# EAGLE design motorControllerMk3 (EAGLE 6.4)
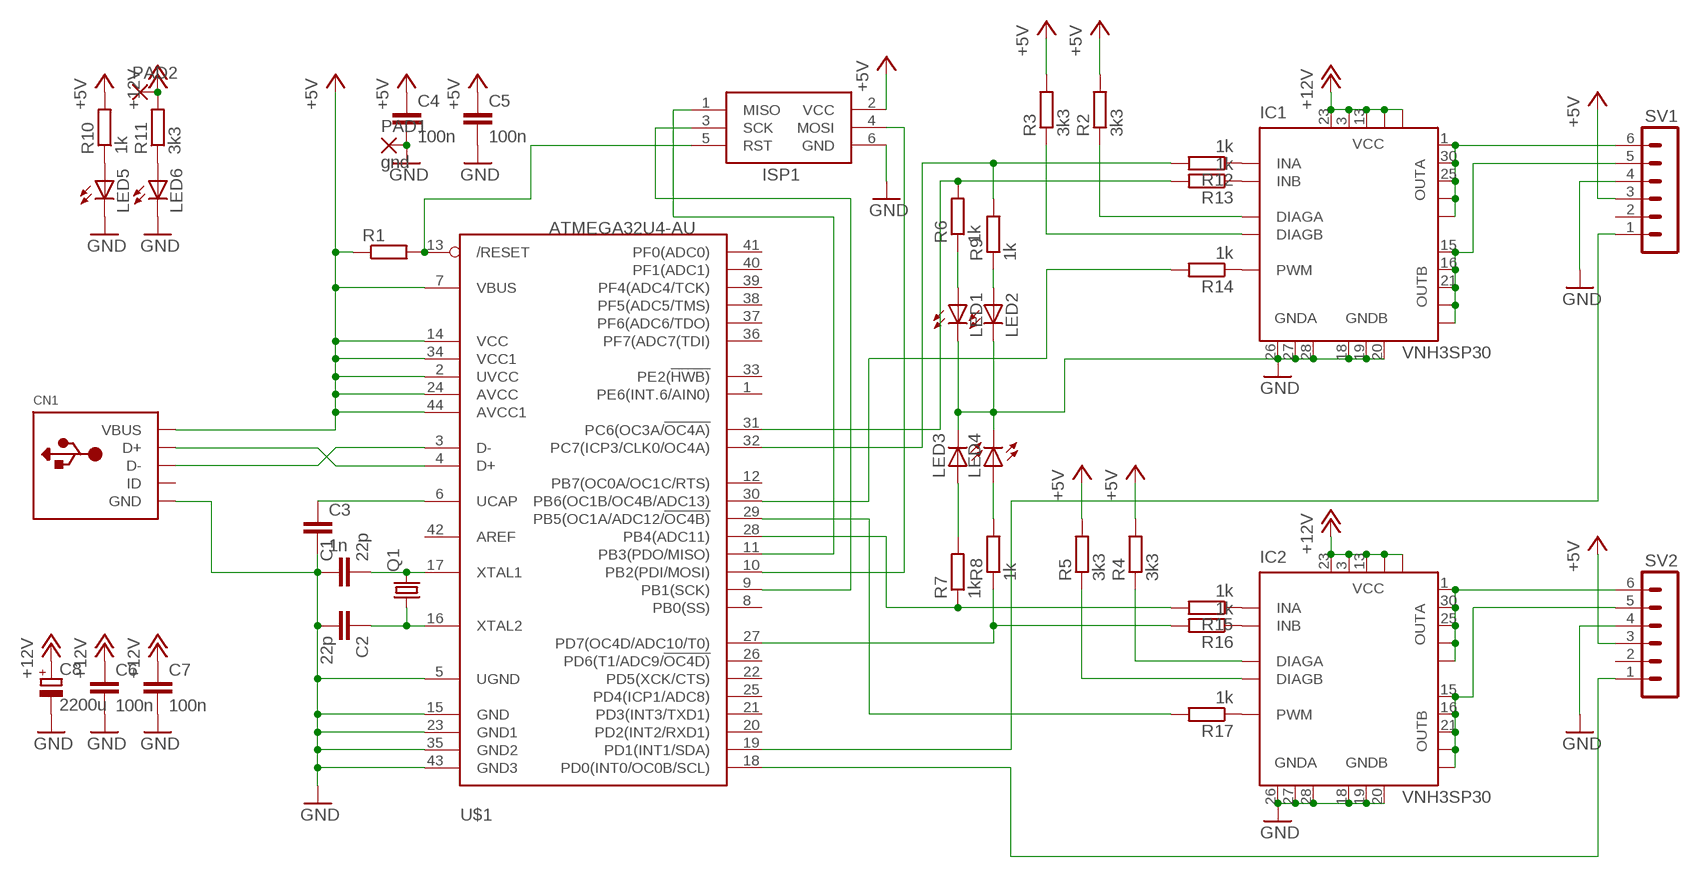
[diagram p0: schematic, sheet 1]

## Parts
C1  22p  C-EUC0805K  [C0805K]
C2  22p  C-EUC0805K  [C0805K]
C3  1n  C-EUC0805K  [C0805K]
C4  100n  C-EUC0805K  [C0805K]
C5  100n  C-EUC0805K  [C0805K]
C6  100n  C-EUC0805K  [C0805K]
C7  100n  C-EUC0805K  [C0805K]
C8  2200u  CPOL-EUE5-8.5  [E5-8,5]
CN1  USBMINIB  [USB-MINIB]
IC1  VNH3SP30  [MULTIPOWERSO-30]
IC2  VNH3SP30  [MULTIPOWERSO-30]
ISP1  AVRISP-6  [AVRISP]
LED1  LEDSML1206  [SML1206]
LED2  LEDSML1206  [SML1206]
LED3  LEDSML1206  [SML1206]
LED4  LEDSML1206  [SML1206]
LED5  LEDSML1206  [SML1206]
LED6  LEDSML1206  [SML1206]
PAD1  gnd  3,81/1,1  [3,81/1,1]
PAD2  3,81/1,1  [3,81/1,1]
Q1  CRYSTALHC49U-V  [HC49U-V]
R1  R-EU_M0805  [M0805]
R2  3k3  R-EU_M0805  [M0805]
R3  3k3  R-EU_M0805  [M0805]
R4  3k3  R-EU_M0805  [M0805]
R5  3k3  R-EU_M0805  [M0805]
R6  1k  R-EU_M0805  [M0805]
R7  1k  R-EU_M0805  [M0805]
R8  1k  R-EU_M0805  [M0805]
R9  1k  R-EU_M0805  [M0805]
R10  1k  R-EU_M0805  [M0805]
R11  3k3  R-EU_M0805  [M0805]
R12  1k  R-EU_M0805  [M0805]
R13  1k  R-EU_M0805  [M0805]
R14  1k  R-EU_M0805  [M0805]
R15  1k  R-EU_M0805  [M0805]
R16  1k  R-EU_M0805  [M0805]
R17  1k  R-EU_M0805  [M0805]
SV1  MA06-1  [MA06-1]
SV2  MA06-1  [MA06-1]
U$1  ATMEGA32U4-AU  [TQFP44]

## Nets
+5V: C4.1 C5.1 CN1.VBUS ISP1.2(VCC) R1.1 R2.2 R3.2 R4.2 R5.2 R10.2 SV1.3 SV2.3 U$1.2(UVCC) U$1.7(VBUS) U$1.14(VCC) U$1.24(AVCC) U$1.34(VCC1) U$1.44(AVCC1)
+12V: C6.1 C7.1 C8.+ IC1.3(VCC) IC1.13(VCC) IC1.23(VCC) IC1.VCC IC1.VCC@1(VCC) IC2.3(VCC) IC2.13(VCC) IC2.23(VCC) IC2.VCC IC2.VCC@1(VCC) PAD2.1(P) R11.2
GND: C1.1 C2.2 C3.2 C4.2 C5.2 C6.2 C7.2 C8.- CN1.GND IC1.18(GNDB) IC1.19(GNDB) IC1.20(GNDB) IC1.26(GNDA) IC1.27(GNDA) IC1.28(GNDA) IC2.18(GNDB) IC2.19(GNDB) IC2.20(GNDB) IC2.26(GNDA) IC2.27(GNDA) IC2.28(GNDA) ISP1.6(GND) LED1.C LED2.C LED3.C LED4.C LED5.C LED6.C PAD1.1(P) SV1.4 SV2.4 U$1.5(UGND) U$1.15(GND) U$1.23(GND1) U$1.35(GND2) U$1.43(GND3)
N$1: ISP1.3(SCK) U$1.9(PB1(SCK))
N$2: C2.1 Q1.1 U$1.16(XTAL2)
N$3: C1.2 Q1.2 U$1.17(XTAL1)
N$4: C3.1 U$1.6(UCAP)
N$5: ISP1.5(RST) R1.2 U$1.13(/RESET)
N$6: ISP1.4(MOSI) U$1.10(PB2(PDI/MOSI))
N$7: ISP1.1(MISO) U$1.11(PB3(PDO/MISO))
N$8: R17.2 U$1.29(PB5(OC1A/ADC12/!OC4B))
N$9: R14.2 U$1.30(PB6(OC1B/OC4B/ADC13))
N$10: CN1.D+ U$1.4(D+)
N$11: CN1.D- U$1.3(D-)
N$12: SV2.1 U$1.18(PD0(INT0/OC0B/SCL))
N$13: IC1.1(OUTA) IC1.25(OUTA) IC1.30(OUTA) IC1.OUTA IC1.OUTA@1(OUTA) SV1.6
N$14: IC1.15(OUTB) IC1.16(OUTB) IC1.21(OUTB) IC1.OUTB IC1.OUTB@1(OUTB) SV1.5
N$15: IC2.15(OUTB) IC2.16(OUTB) IC2.21(OUTB) IC2.OUTB IC2.OUTB@1(OUTB) SV2.5
N$16: IC2.1(OUTA) IC2.25(OUTA) IC2.30(OUTA) IC2.OUTA IC2.OUTA@1(OUTA) SV2.6
N$17: SV1.1 U$1.19(PD1(INT1/SDA))
N$18: IC2.6(DIAGA) R4.1
N$19: IC2.10(DIAGB) R5.1
N$20: IC1.6(DIAGA) R2.1
N$21: IC1.10(DIAGB) R3.1
N$22: LED4.A R8.2
N$23: R8.1 R16.2 U$1.27(PD7(OC4D/ADC10/T0))
N$24: R7.1 R15.2 U$1.28(PB4(ADC11))
N$25: R6.2 R13.2 U$1.31(PC6(OC3A/!OC4A))
N$26: R9.2 R12.2 U$1.32(PC7(ICP3/CLK0/OC4A))
N$27: LED3.A R7.2
N$28: LED5.A R10.1
N$29: LED6.A R11.1
N$30: LED2.A R9.1
N$31: LED1.A R6.1
N$32: IC1.5(INA) R12.1
N$33: IC1.11(INB) R13.1
N$34: IC1.8(PWM) R14.1
N$35: IC2.5(INA) R15.1
N$36: IC2.11(INB) R16.1
N$37: IC2.8(PWM) R17.1
Unconnected: CN1.ID SV1.2 SV2.2 U$1.1(PE6(INT.6/AIN0)) U$1.8(PB0(SS)) U$1.12(PB7(OC0A/OC1C/RTS)) U$1.20(PD2(INT2/RXD1)) U$1.21(PD3(INT3/TXD1)) U$1.22(PD5(XCK/CTS)) U$1.25(PD4(ICP1/ADC8)) U$1.26(PD6(T1/ADC9/!OC4D)) U$1.33(PE2(!HWB)) U$1.36(PF7(ADC7(TDI)) U$1.37(PF6(ADC6/TDO)) U$1.38(PF5(ADC5/TMS)) U$1.39(PF4(ADC4/TCK)) U$1.40(PF1(ADC1)) U$1.41(PF0(ADC0)) U$1.42(AREF)

## Library data of the parts
C1-C7 = rcl:C-EU: CAPACITOR, European symbol
C8 = rcl:CPOL-EU: POLARIZED CAPACITOR, European symbol
CN1 = adafruit:USB: USB Connectors USBMINIB - Surface Mount Female Mini-B USB Connector 4UConnector: 06564 By microbuilder.eu Thru-hole RA Female Mini-B USB Connector 4UConnector: 18732 By ladyada.net
IC1 IC2 = st-microelectronics:VNH3SP30: FULLY INTEGRATED H-BRIDGE MOTOR DRIVER Source: http://pdf1.alldatasheet.com/datasheet-pdf/view/84563/STMICROELECTRONICS/VNH3SP30.html; MPN: VNH3SP30-E; OC_FARNELL: 1739420; OC_NEWARK: 33R1486
ISP1 = adafruit:AVRISP: AVR ISP HEADER Standard 6 pin header for AVR programming
LED1-LED6 = led:LED: LED OSRAM: - CHIPLED LG R971, LG N971, LY N971, LG Q971, LY Q971, LO R971, LY R971 LH N974, LH R974 LS Q976, LO Q976, LY Q976 LO Q996 - Hyper CHIPLED LW Q18S LB Q993, LB Q99A, LB R99A - SideLED LS A670, LO A670, LY A670, LG A670, LP A670 LB A673, LV A673, LT A673, LW A673 LH A674 LY A675 LS A676, LA A676, LO A676, LY A676, LW A676 LS A679, LY A679, LG A679 - Hyper Micro SIDELED® LS Y876, LA Y876, LO Y876, LY Y876 LT Y87S - SmartLED LW L88C, LW L88S LB L89C, LB L89S, LG L890 LS L89K, LO L89K, LY L89K LS L896, LA L896, LO L896, LY L896 - TOPLED LS T670, LO T670, LY T670, LG T670, LP T670 LSG T670, LSP T670, LSY T670, LOP T670, LYG T670 LG T671, LOG T671, LSG T671 LB T673, LV T673, LT T673, LW T673 LH T674 LS T676, LA T676, LO T676, LY T676, LB T676, LH T676, LSB T676, LW T676 LB T67C, LV T67C, LT T67C, LS T67K, LO T67K, LY T67K, LW E67C LS E67B, LA E67B, LO E67B, LY E67B, LB E67C, LV E67C, LT E67C LW T67C LS T679, LY T679, LG T679 LS T770, LO T770, LY T770, LG T770, LP T770 LB T773, LV T773, LT T773, LW T773 LH T774 LS E675, LA E675, LY E675, LS T675 LS T776, LA T776, LO T776, LY T776, LB T776 LHGB T686 LT T68C, LB T68C - Hyper Mini TOPLED® LB M676 - Mini TOPLED Santana® LG M470 LS M47K, LO M47K, LY M47K Source: http://www.osram.convergy.de LUXEON: - LUMILED® LXK2-PW12-R00, LXK2-PW12-S00, LXK2-PW14-U00, LXK2-PW14-V00 LXK2-PM12-R00, LXK2-PM12-S00, LXK2-PM14-U00 LXK2-PE12-Q00, LXK2-PE12-R00, LXK2-PE12-S00, LXK2-PE14-T00, LXK2-PE14-U00 LXK2-PB12-K00, LXK2-PB12-L00, LXK2-PB12-M00, LXK2-PB14-N00, LXK2-PB14-P00, LXK2-PB14-Q00 LXK2-PR12-L00, LXK2-PR12-M00, LXK2-PR14-Q00, LXK2-PR14-R00 LXK2-PD12-Q00, LXK2-PD12-R00, LXK2-PD12-S00 LXK2-PH12-R00, LXK2-PH12-S00 LXK2-PL12-P00, LXK2-PL12-Q00, LXK2-PL12-R00 Source: www.luxeon.com KINGBRIGHT: KA-3528ASYC Source: www.kingbright.com
PAD1 PAD2 = wirepad:3,81/1,1: THROUGH-HOLE PAD
Q1 = adafruit:CRYSTAL: CRYSTAL; OC_FARNELL: 1666969; OC_NEWARK: unknown
R1-R17 = rcl:R-EU_: RESISTOR, European symbol
SV1 SV2 = con-lstb:MA06-1: PIN HEADER; OC_FARNELL: unknown; OC_NEWARK: unknown
U$1 = adafruit:ATMEGA32U4: http://www.ladyada.net/library/eagle

## Board
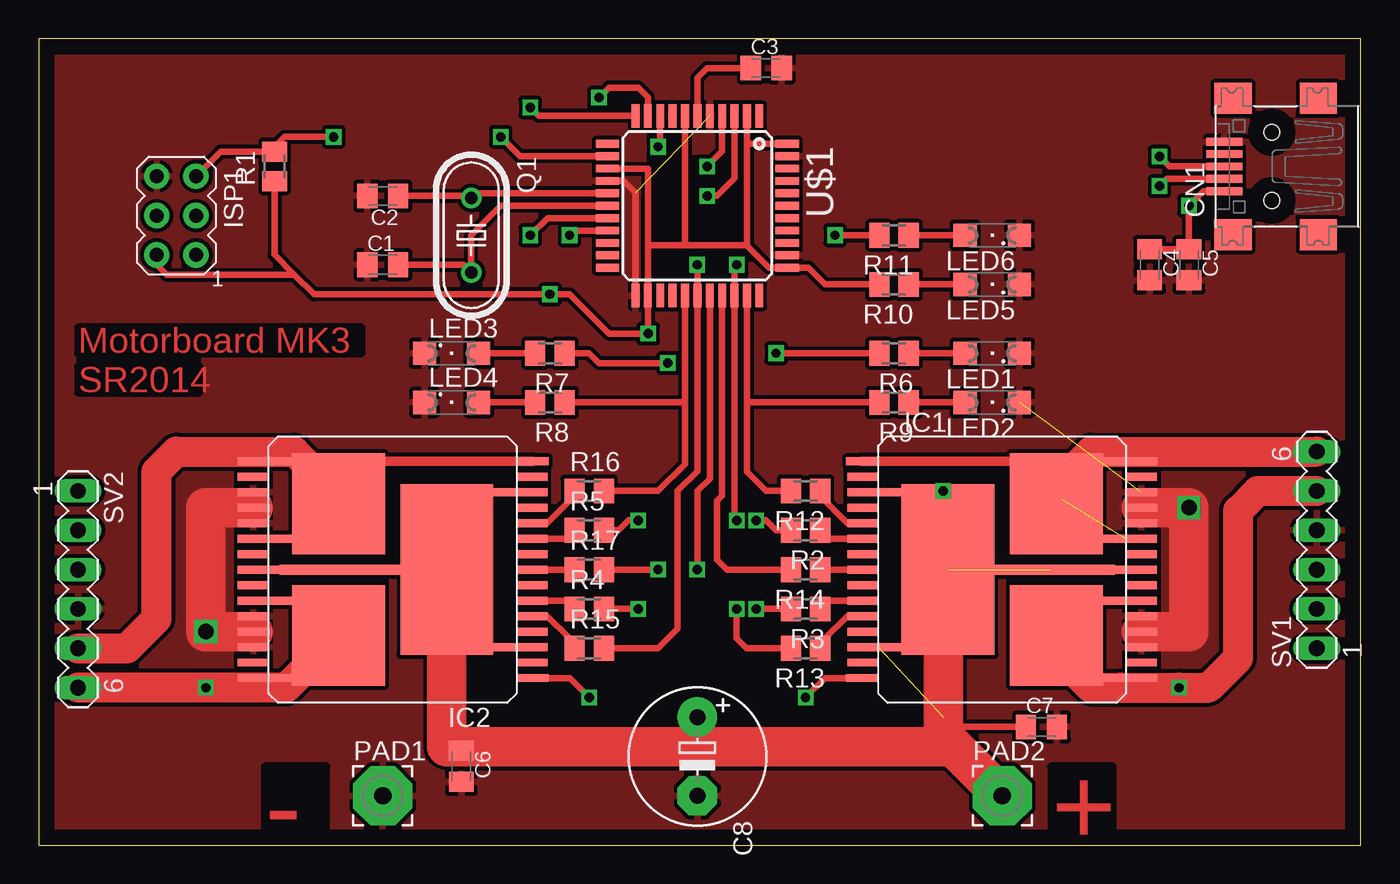
[diagram p1: board, top side]
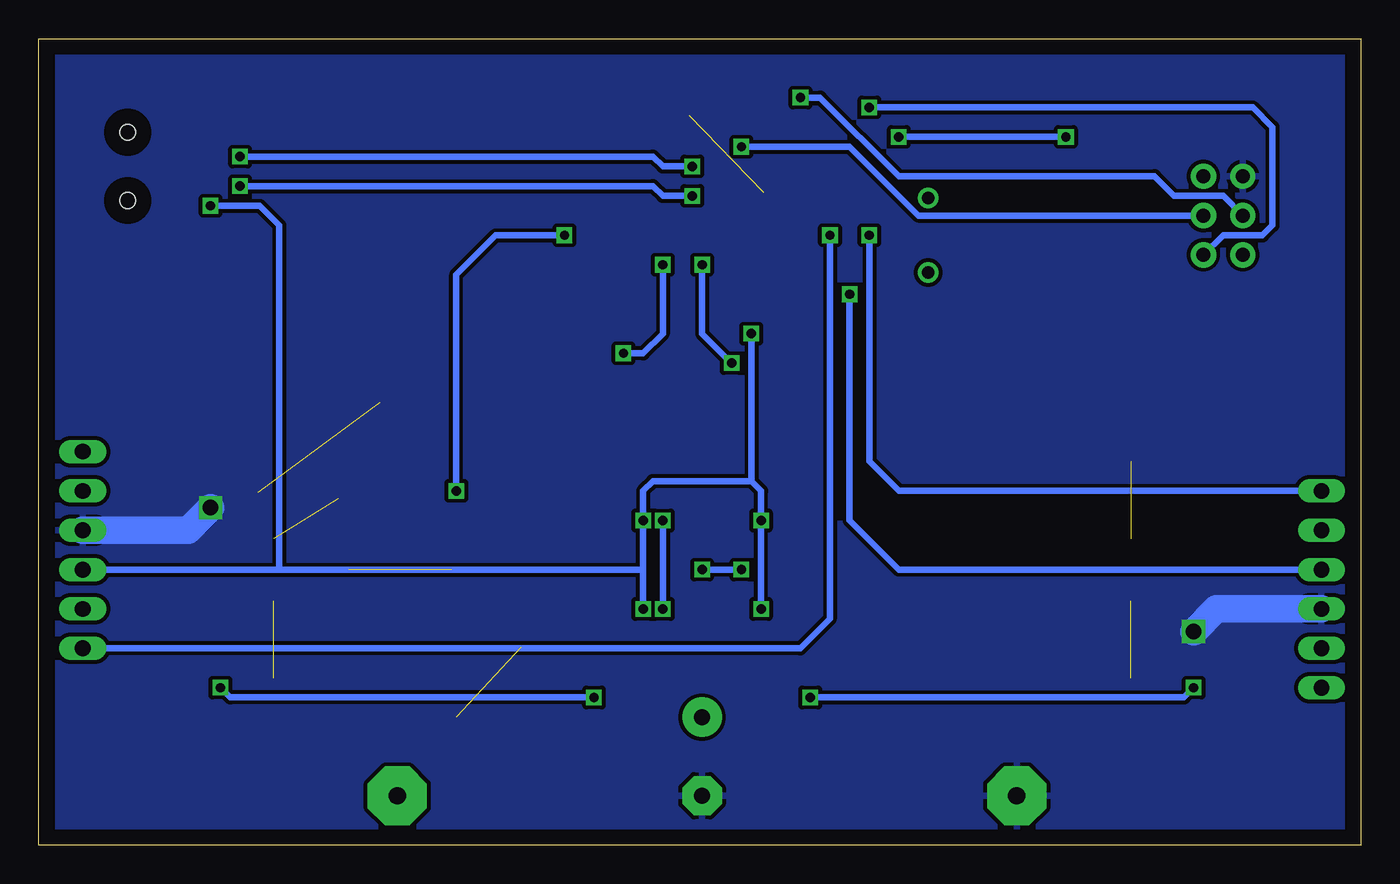
[diagram p2: board, bottom side, seen from below]

Size 85.39 x 52.06 mm. Coordinates in mm from the lower left corner, seen from the top.
Outline: 0,0 85.39,0 85.39,52.06 0,52.06 0,0
Copper layers (1*16): Top 0.035mm / dielectric 1.5mm / Bottom 0.035mm
Design rules "default *": minimum track width 10mil, minimum drill 24mil, track to track 10mil, track to pad 10mil, pad to pad 10mil, via to via 10mil, smd to smd 10mil, copper to edge 40mil, drill to drill 8mil, minimum pad ring 10mil, minimum via ring 8mil, stop-mask expansion 4mil, vias tented up to drill 0mil, thermal gap 10mil

### Footprints (pad centres in the part's own frame; a part is rotated, then mirrored left to right if it is on the bottom)
C0805K = smd 1.3 x 1.6: 1 -1,0; 2 1,0
E5-8,5 = drill 1.016 pad 2.54: + -2.54,0 | drill 1.016 pad 2.54 octagon: - 2.54,0
USB-MINIB = smd 0.5 x 2.308: D+ 0,4.064; D- -0.8,4.064; GND 1.6,4.064; ID 0.8,4.064; VBUS -1.6,4.064 | smd 2 x 2.4: GND1 -4.4,-2; GND2 -4.4,3.5; GND3 4.4,3.5; GND4 4.4,-2 | hole 1: -2.2,1; 2.2,1
MULTIPOWERSO-30 = smd 0.508 x 2: 1 -7,-9.08; 2 -6,-9; 4 -4,-9; 5 -3,-9; 6 -2,-9; 7 -1,-9; 8 0,-9; 9 1,-9; 10 2,-9; 11 3,-9; 12 4,-9; 14 6,-9; 15 7,-9.08; 17 6,9; 18 5,9; 19 4,9; 20 3,9; 22 1,9; 24 -1,9; 26 -3,9; 27 -4,9; 28 -5,9; 29 -6,9 | smd 0.508 x 4: 3 -5,-8; 13 5,-8; 16 7,8; 21 2,8; 23 0,8; 25 -2,8; 30 -7,8 | smd 6.5 x 6: OUTA -4.25,3.5; OUTB 4.25,3.5 | smd 2 x 0.508: OUTA@1 -5.73,2.325; OUTB@1 4.46,2.325 | smd 11 x 6: VCC 0,-3.5 | smd 0.65 x 8.3: VCC@1 0,3.145
AVRISP = drill 0.9 pad 1.626: 1 -1.27,2.54; 2 1.27,2.54; 3 -1.27,0; 4 1.27,0; 5 -1.27,-2.54; 6 1.27,-2.54
SML1206 = smd 1.5 x 1.5: A 1.75,0; C -1.75,0
3,81/1,1 = drill 1.118 pad 3.81 octagon: 1 0,0
HC49U-V = drill 0.813: 1 -2.413,0; 2 2.413,0
M0805 = smd 1.3 x 1.6: 1 -0.95,0; 2 0.95,0
MA06-1 = drill 1.016 long: 1 -6.35,0; 2 -3.81,0; 3 -1.27,0; 4 1.27,0; 5 3.81,0; 6 6.35,0
TQFP44 = smd 1.5 x 0.5: 1 -5.8,4; 2 -5.8,3.2; 3 -5.8,2.4; 4 -5.8,1.6; 5 -5.8,0.8; 6 -5.8,0; 7 -5.8,-0.8; 8 -5.8,-1.6; 9 -5.8,-2.4; 10 -5.8,-3.2; 11 -5.8,-4; 23 5.8,-4; 24 5.8,-3.2; 25 5.8,-2.4; 26 5.8,-1.6; 27 5.8,-0.8; 28 5.8,0; 29 5.8,0.8; 30 5.8,1.6; 31 5.8,2.4; 32 5.8,3.2; 33 5.8,4 | smd 0.5 x 1.5: 12 -4,-5.8; 13 -3.2,-5.8; 14 -2.4,-5.8; 15 -1.6,-5.8; 16 -0.8,-5.8; 17 0,-5.8; 18 0.8,-5.8; 19 1.6,-5.8; 20 2.4,-5.8; 21 3.2,-5.8; 22 4,-5.8; 34 4,5.8; 35 3.2,5.8; 36 2.4,5.8; 37 1.6,5.8; 38 0.8,5.8; 39 0,5.8; 40 -0.8,5.8; 41 -1.6,5.8; 42 -2.4,5.8; 43 -3.2,5.8; 44 -4,5.8

### Placement (x,y rotation side)
C1  22.23,37.47 0 top
C2  22.23,41.91 180 top
C3  46.99,50.16 0 top
C4  71.75,37.47 270 top
C5  74.3,37.47 270 top
C6  27.3,5.08 270 top
C7  64.77,7.62 0 top
C8  42.55,5.71 270 top
CN1  80.64,43.81 90 top
IC1  62.23,17.78 270 top
IC2  22.86,17.78 90 top
ISP1  8.89,40.64 180 top
LED1  61.59,31.75 180 top
LED2  61.59,28.57 180 top
LED3  26.67,31.75 0 top
LED4  26.67,28.57 0 top
LED5  61.59,36.2 180 top
LED6  61.59,39.37 180 top
PAD1  22.23,3.17 0 top
PAD2  62.23,3.17 0 top
Q1  27.94,39.37 270 top
R1  15.24,43.81 90 top
R2  49.53,20.32 180 top
R3  49.53,15.24 180 top
R4  35.56,15.24 0 top
R5  35.56,20.32 0 top
R6  55.24,31.75 180 top
R7  33.02,31.75 180 top
R8  33.02,28.57 180 top
R9  55.24,28.57 180 top
R10  55.24,36.2 180 top
R11  55.24,39.37 180 top
R12  49.53,22.86 180 top
R13  49.53,12.7 180 top
R14  49.53,17.78 180 top
R15  35.56,12.7 0 top
R16  35.56,22.86 0 top
R17  35.56,17.78 0 top
SV1  82.55,19.05 90 top
SV2  2.54,16.51 270 top
U$1  42.55,41.27 270 top

### Tracks (layer width: path | path; a pad name or v marks a point on that pad's centre or on a via)
+5V  (via drill 0.6)
  Top 0.406: R4.2 v38.73,15.24 | R3.2 v46.35,15.24 | R5.2 37.47,20.32 38.1,20.95 v38.73,20.95 | R2.2 47.62,20.32 46.99,20.95 v46.35,20.95 | 39.36,38.74 U$1.24 39.34,33.68 v39.37,33.02 36.83,33.02 34.29,35.56 v33.02,35.56 17.78,35.56 16.51,36.83 | 39.36,38.74 39.37,41.27 | 39.37,41.27 39.37,41.91 | 39.37,41.27 39.37,41.28 39.37,43.67 U$1.14 | 45.72,38.73 47.18,37.27 U$1.34 49.72,37.27 50.8,36.2 R10.2 | 45.72,38.73 41.74,38.73 | 41.74,38.73 39.36,38.73 39.36,38.74 | U$1.7 41.74,38.73 | U$1.2 45.74,45.27 | 45.74,45.27 45.74,38.73 45.72,38.73 | U$1.44 45.74,45.27 | CN1.VBUS 75.23,42.22 v74.3,41.27 C5.1 C4.1 | 16.51,36.83 15.24,38.1 R1.1 | ISP1.2 7.62,37.47 8.26,36.83 16.51,36.83
  Bottom 0.406: v38.73,15.24 v38.73,20.95 38.73,22.86 39.37,23.5 | v46.35,15.24 46.35,17.78 | 46.35,17.78 v46.35,20.95 46.35,22.86 45.72,23.5 39.37,23.5 | v39.37,33.02 39.37,23.5 | SV1.3 69.85,17.78 | SV2.3 29.84,17.78 33.02,20.95 v33.02,35.56 | v74.3,41.27 71.12,41.27 69.85,40.01 69.85,17.78 | 69.85,17.78 46.35,17.78
+12V  (via drill 0.6)  (2 unrouted)
  Top 0.406: 58.42,6.35 43.18,6.35 42.55,5.71 | v51.44,39.37 R11.2 | 27.94,6.35 27.94,6.99 27.3,6.99 26.67,6.35 26.67,12.06 26.04,12.7 30.78,12.7 IC2.3 | C7.1 59.05,7.62 58.42,8.26 | IC2.13 27.86,22.78 26.67,21.59 26.67,18.09 IC2.VCC IC2.VCC@1 IC2.23 | IC1.3 58.34,22.78 v58.42,22.86 58.42,17.78 | IC1.VCC@1 IC1.23 | C6.1 25.73,7.62 26.36,6.99
  Top 1.778: 42.55,5.71 C8.+
  Top 2.54: IC2.VCC 26.36,6.99 26.36,6.35 26.67,6.35 27.94,6.35 58.42,6.35 58.42,6.99 | 58.42,6.99 58.42,8.26 58.42,17.47 IC1.VCC 58.42,17.78 | PAD2.1 58.42,6.99
  Bottom 0.406: v51.44,39.37 55.88,39.37 58.42,36.83 v58.42,22.86
GND  (via drill 1)  (2 unrouted)
  Top 0.406: U$1.23 38.55,42.1 37.77,42.88 U$1.15
  Top 2.54: IC2.19 10.79,21.78 v10.79,13.78 IC2.27 | IC1.27 v74.3,21.78 74.3,13.78 IC1.19
  Bottom 1.778: SV1.4 75.75,20.32 v74.3,21.78 | SV2.4 9.34,15.24 v10.79,13.78
  pour Top: 0,52.07 84.45,52.07 84.45,0 0,0
  pour Bottom: 0,52.07 0,0 84.45,0 84.45,52.07
N$1  (via drill 0.6)
  Top 0.406: U$1.9 40.15,45.23 v40.01,45.09
  Bottom 0.406: v40.01,45.09 33.02,45.09 28.57,40.64 ISP1.3
N$2
  Top 0.406: U$1.16 28.23,42.08 Q1.1 27.81,41.91 C2.1
N$3
  Top 0.406: U$1.17 29.84,41.27 27.94,39.37 Q1.2 | 27.81,36.83 Q1.2 | C1.2 27.43,37.47 Q1.2
N$4
  Top 0.406: U$1.6 42.55,49.53 43.18,50.16 C3.1
N$5  (via drill 0.6)
  Top 0.406: U$1.13 31.09,44.48 v29.84,45.72 | v19.05,45.72 15.88,45.72 15.24,45.09 R1.2 11.74,44.77 ISP1.5
  Bottom 0.406: v29.84,45.72 v19.05,45.72
N$6  (via drill 0.6)
  Top 0.406: U$1.10 39.34,48.28 38.73,48.9 36.83,48.9 v36.2,48.26
  Bottom 0.406: v36.2,48.26 34.92,48.26 29.84,43.18 13.34,43.18 12.06,41.91 8.89,41.91 ISP1.4
N$7  (via drill 0.6)
  Top 0.406: U$1.11 32.3,47.08 v31.75,47.62
  Bottom 0.406: v31.75,47.62 6.99,47.62 5.71,46.35 5.71,40.01 6.35,39.37 8.89,39.37 ISP1.1
N$8  (via drill 0.6)
  Top 0.406: R17.2 v40.01,17.78 | U$1.29 43.34,23.66 42.55,22.86 v42.55,17.78
  Bottom 0.406: v40.01,17.78 v42.55,17.78
N$9
  Top 0.406: R14.2 44.45,17.78 43.81,18.41 43.81,22.23 44.15,22.55 U$1.30
N$10  (via drill 0.6)
  Top 0.406: U$1.4 44.15,44.78 v43.18,43.81 | CN1.D+ 73.03,43.81 v72.39,44.45
  Bottom 0.406: v72.39,44.45 45.72,44.45 45.09,43.81 v43.18,43.81
N$11  (via drill 0.6)
  Top 0.406: U$1.3 44.95,43.04 43.81,41.91 v43.18,41.91 | CN1.D- 72.86,43.02 v72.39,42.55
  Bottom 0.406: v72.39,42.55 45.72,42.55 45.09,41.91 v43.18,41.91
N$12  (via drill 0.6)
  Top 0.406: U$1.18 32.85,40.48 v31.75,39.37
  Bottom 0.406: v31.75,39.37 31.75,24.77 29.84,22.86 SV2.1
N$13  (1 unrouted)
  Top 0.406: 66.06,23.51 66.06,22.36 IC1.OUTA | IC1.30 68.56,24.78 67.94,25.4
  Top 0.61: IC1.1 62.98,24.78 IC1.OUTA
  Top 1.93: IC1.OUTA@1 66.06,23.51 67.94,25.4 SV1.6
N$14  (via drill 0.6)  (1 unrouted)
  Top 0.406: IC1.15 50.78,10.78 v49.53,9.53 | IC1.OUTB 64.77,13.53 IC1.OUTB@1 | IC1.16 70.23,10.54 69.85,10.16
  Top 1.93: IC1.OUTB 65.73,12.38 67.94,10.16 69.85,10.16 v73.66,10.16 75.56,10.16 77.47,12.06 77.47,21.59 78.74,22.86 SV1.5
  Bottom 0.406: v49.53,9.53 73.03,9.53 v73.66,10.16
N$15  (1 unrouted)
  Top 0.406: IC2.OUTB@1 19.57,22.24 IC2.OUTB | 16.51,25.4 15.48,25.4 IC2.16
  Top 0.61: IC2.15 22.11,24.78 IC2.OUTB
  Top 1.93: SV2.5 5.71,12.7 7.62,14.61 7.62,24.13 8.89,25.4 16.51,25.4 19.36,22.55 IC2.OUTB
N$16  (via drill 0.6)  (1 unrouted)
  Top 0.406: IC2.1 34.3,10.78 v35.56,9.53 | IC2.OUTA@1 20.54,12.36 IC2.OUTA | 15.99,10.16 15.48,10.16 IC2.30
  Top 1.93: IC2.OUTA 15.99,10.16 v10.79,10.16 SV2.6
  Bottom 0.406: v35.56,9.53 11.43,9.53 v10.79,10.16
N$17  (via drill 0.6)
  Top 0.406: U$1.19 34.59,39.67 v34.29,39.37
  Bottom 0.406: v34.29,39.37 34.29,14.61 36.2,12.7 SV1.1
N$18
  Top 0.406: IC2.6 34.07,15.78 R4.1
N$19
  Top 0.406: IC2.10 34.07,19.78 R5.1
N$20
  Top 0.406: IC1.6 51.02,19.78 R2.1
N$21
  Top 0.406: IC1.10 51.02,15.78 R3.1
N$22
  Top 0.406: R8.2 LED4.A
N$23
  Top 0.406: U$1.27 41.74,28.57 | 41.74,28.57 41.74,24.6 40.01,22.86 R16.2 | R8.1 41.74,28.57
N$24  (via drill 0.6)
  Top 0.406: R15.2 40.01,12.7 41.27,13.97 41.27,22.86 42.55,24.13 U$1.28 v42.55,37.47 | v40.64,31.11 36.2,31.11 35.56,31.75 R7.1
  Bottom 0.406: v42.55,37.47 42.55,33.02 v40.64,31.11
N$25  (via drill 0.6)
  Top 0.406: v45.09,20.95 44.95,21.09 U$1.31 44.95,37.33 v45.09,37.47 | v45.09,15.24 45.09,13.34 45.72,12.7 R13.2 | v47.62,31.75 R6.2
  Bottom 0.406: v45.09,20.95 v45.09,15.24 | v45.09,37.47 45.09,33.02 46.35,31.75 v47.62,31.75
N$26
  Top 0.406: U$1.32 45.74,28.57 | 45.74,28.57 45.74,24.11 46.99,22.86 R12.2 | R9.2 45.74,28.57
N$27
  Top 0.406: R7.2 LED3.A
N$28
  Top 0.406: R10.1 LED5.A
N$29
  Top 0.406: R11.1 LED6.A
N$30
  Top 0.406: R9.1 LED2.A
N$31
  Top 0.406: R6.1 LED1.A
N$32
  Top 0.406: IC1.5 52.24,20.78 50.8,22.23 50.8,22.54 R12.1
N$33
  Top 0.406: IC1.11 52.24,14.78 50.8,13.34 50.8,13.02 R13.1
N$34
  Top 0.406: IC1.8 R14.1
N$35
  Top 0.406: IC2.5 32.84,14.78 34.29,13.34 34.29,13.02 R15.1
N$36
  Top 0.406: IC2.11 32.84,20.78 34.29,22.23 34.29,22.54 R16.1
N$37
  Top 0.406: IC2.8 R17.1

### Text on the board
Top: Motorboard MK3 | SR2014 | - | +